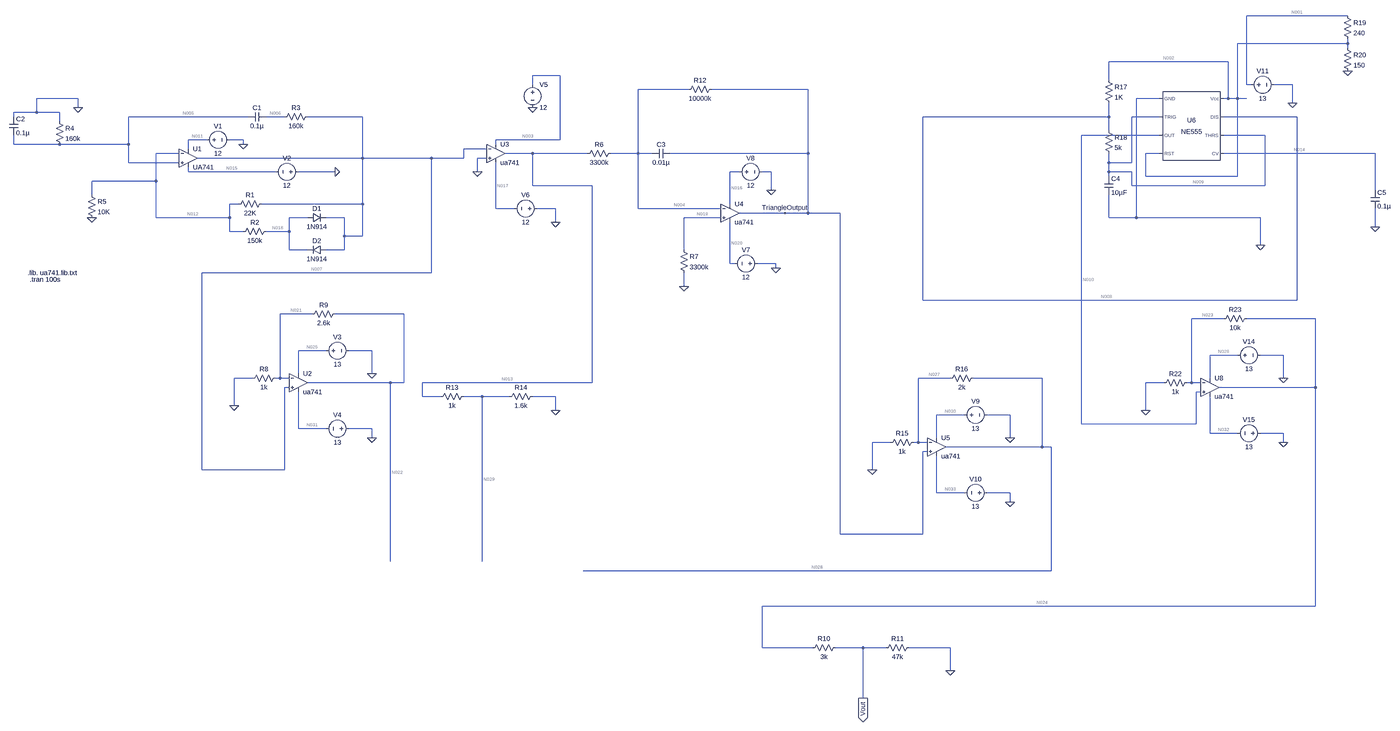
[diagram p0: schematic Final perfect.asc, whole sheet]
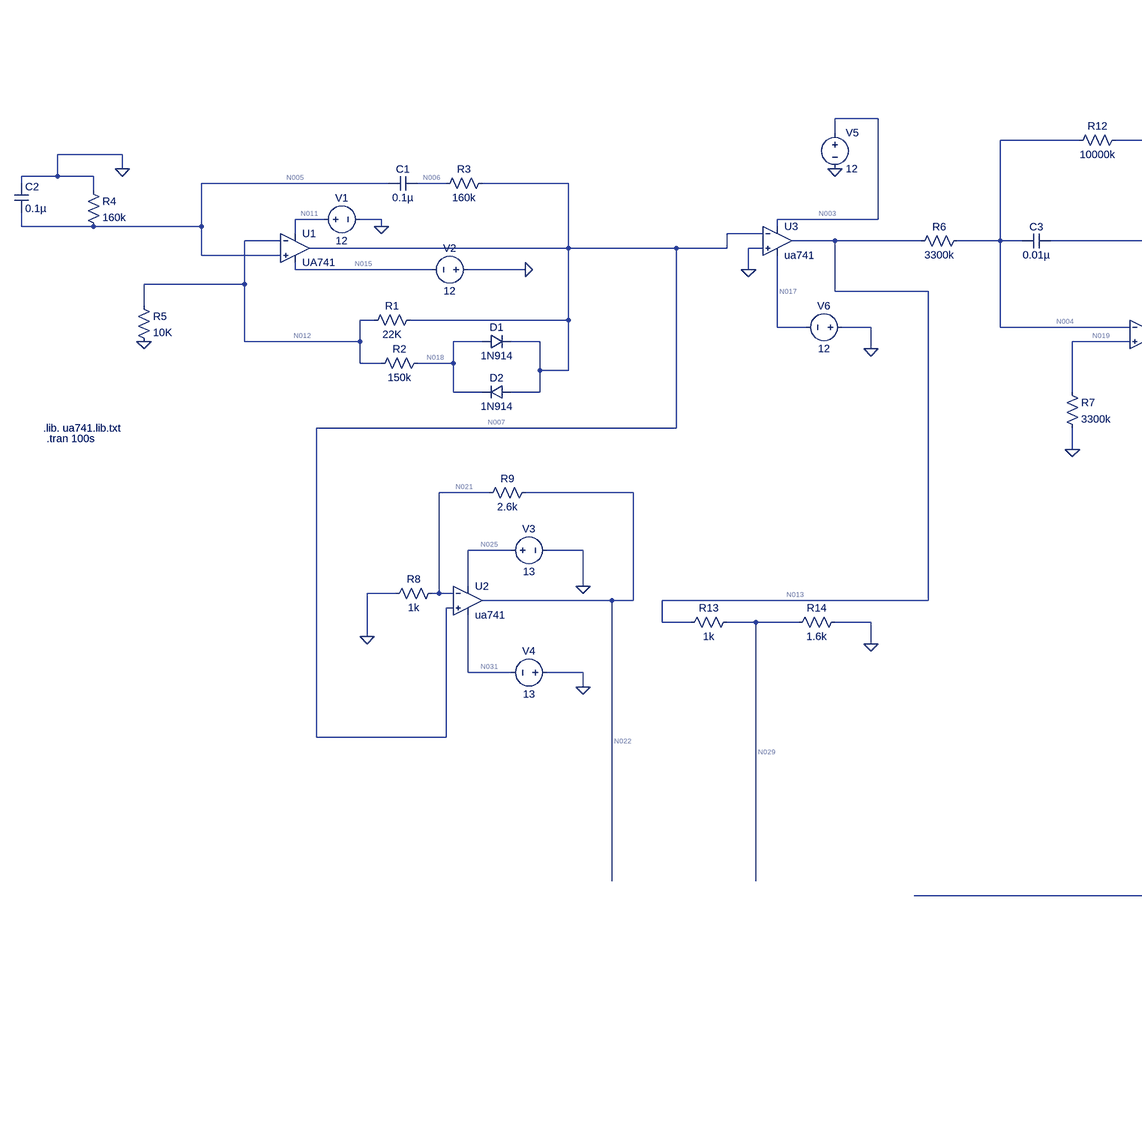
[diagram p1: schematic Final perfect.asc, part, row 1 of 1, column 1 of 2]
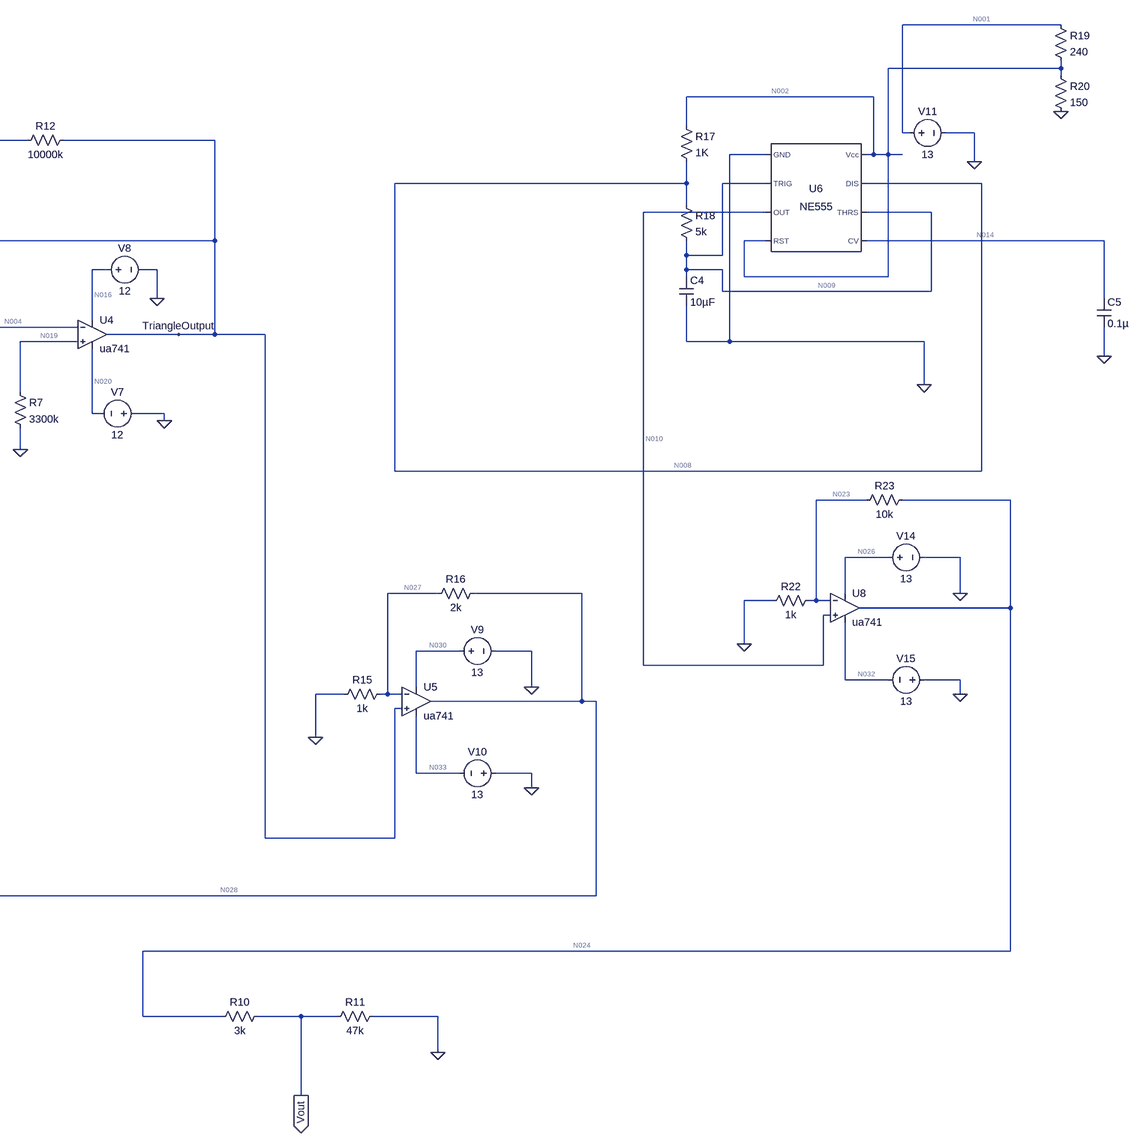
[diagram p2: schematic Final perfect.asc, part, row 1 of 1, column 2 of 2]
Final perfect.asc, the LTspice schematic file:
Version 4
SHEET 1 5472 2544
WIRE 4304 -352 3952 -352
WIRE 4304 -256 4304 -272
WIRE 4304 -256 3920 -256
WIRE 4304 -240 4304 -256
WIRE 3888 -192 3472 -192
WIRE 1536 -144 1440 -144
WIRE 3472 -128 3472 -192
WIRE 1440 -112 1440 -144
WIRE 3952 -112 3952 -352
WIRE 3968 -112 3952 -112
WIRE 4112 -112 4048 -112
WIRE 1984 -96 1808 -96
WIRE 2400 -96 2064 -96
WIRE -144 -64 -288 -64
WIRE 3648 -64 3568 -64
WIRE 3888 -64 3888 -192
WIRE 3888 -64 3872 -64
WIRE 3920 -64 3920 -256
WIRE 3920 -64 3888 -64
WIRE 3952 -64 3920 -64
WIRE 4112 -48 4112 -112
WIRE -144 -32 -144 -64
WIRE -288 -16 -288 -64
WIRE -288 -16 -368 -16
WIRE -208 -16 -288 -16
WIRE -368 0 -368 -16
WIRE 448 0 32 0
WIRE 576 0 512 0
WIRE 848 0 656 0
WIRE 3472 0 3472 -48
WIRE 3472 0 2800 0
WIRE 3648 0 3552 0
WIRE 4128 0 3872 0
WIRE -208 16 -208 -16
WIRE 3472 48 3472 0
WIRE 3648 64 3376 64
WIRE 4016 64 3872 64
WIRE 304 80 240 80
WIRE 432 80 384 80
WIRE 1536 80 1536 -144
WIRE 1536 80 1312 80
WIRE -368 96 -368 64
WIRE -208 96 -368 96
WIRE 32 96 32 0
WIRE 32 96 -208 96
WIRE 432 96 432 80
WIRE 1312 96 1312 80
WIRE 240 112 240 80
WIRE 1280 112 1200 112
WIRE 208 128 128 128
WIRE 1440 128 1344 128
WIRE 1632 128 1440 128
WIRE 1808 128 1808 -96
WIRE 1808 128 1712 128
WIRE 1856 128 1808 128
WIRE 2400 128 2400 -96
WIRE 2400 128 1920 128
WIRE 3648 128 3600 128
WIRE 4400 128 3872 128
WIRE 848 144 848 0
WIRE 848 144 272 144
WIRE 1088 144 848 144
WIRE 1200 144 1200 112
WIRE 1200 144 1088 144
WIRE 1280 144 1248 144
WIRE 32 160 32 96
WIRE 208 160 32 160
WIRE 3472 160 3472 128
WIRE 3552 160 3552 0
WIRE 3552 160 3472 160
WIRE 240 192 240 176
WIRE 544 192 240 192
WIRE 752 192 624 192
WIRE 1248 192 1248 144
WIRE 2160 192 2128 192
WIRE 2272 192 2240 192
WIRE 3472 192 3472 160
WIRE 3552 192 3472 192
WIRE 3472 208 3472 192
WIRE 3600 208 3600 128
WIRE 3920 208 3920 -64
WIRE 3920 208 3600 208
WIRE 128 224 128 128
WIRE 128 224 -96 224
WIRE 1440 240 1440 128
WIRE 1648 240 1440 240
WIRE 3552 240 3552 192
WIRE 4016 240 4016 64
WIRE 4016 240 3552 240
WIRE 2272 256 2272 192
WIRE 4400 256 4400 128
WIRE -96 272 -96 224
WIRE 416 304 384 304
WIRE 848 304 848 144
WIRE 848 304 496 304
WIRE 2128 304 2128 192
WIRE 1312 320 1312 160
WIRE 1376 320 1312 320
WIRE 1520 320 1456 320
WIRE 1808 320 1808 128
WIRE 2096 320 1808 320
WIRE 2320 336 2160 336
WIRE 2400 336 2400 128
WIRE 2400 336 2320 336
WIRE 2512 336 2400 336
WIRE 128 352 128 224
WIRE 384 352 384 304
WIRE 384 352 128 352
WIRE 656 352 592 352
WIRE 784 352 720 352
WIRE 2096 352 1968 352
WIRE 3472 352 3472 272
WIRE 3568 352 3568 -64
WIRE 3568 352 3472 352
WIRE 4000 352 3568 352
WIRE 1520 368 1520 320
WIRE 4400 384 4400 320
WIRE 384 400 384 352
WIRE 432 400 384 400
WIRE 592 400 592 352
WIRE 592 400 512 400
WIRE 784 416 784 352
WIRE 848 416 848 304
WIRE 848 416 784 416
WIRE 4000 448 4000 352
WIRE 592 464 592 400
WIRE 656 464 592 464
WIRE 784 464 784 416
WIRE 784 464 720 464
WIRE 1968 464 1968 352
WIRE 2128 512 2128 368
WIRE 2144 512 2128 512
WIRE 2288 512 2224 512
WIRE 2288 528 2288 512
WIRE 1088 544 1088 144
WIRE 1088 544 288 544
WIRE 1968 592 1968 544
WIRE 2800 640 2800 0
WIRE 4128 640 4128 0
WIRE 4128 640 2800 640
WIRE 672 688 560 688
WIRE 992 688 752 688
WIRE 3872 704 3760 704
WIRE 4192 704 3952 704
WIRE 720 816 624 816
WIRE 880 816 800 816
WIRE 3920 832 3824 832
WIRE 4080 832 4000 832
WIRE 624 896 624 816
WIRE 880 896 880 816
WIRE 464 912 400 912
WIRE 560 912 560 688
WIRE 560 912 544 912
WIRE 592 912 560 912
WIRE 2896 912 2784 912
WIRE 3216 912 2976 912
WIRE 3824 912 3824 832
WIRE 4080 912 4080 832
WIRE 944 928 656 928
WIRE 992 928 992 688
WIRE 992 928 944 928
WIRE 1648 928 1648 240
WIRE 1648 928 1056 928
WIRE 3664 928 3600 928
WIRE 3760 928 3760 704
WIRE 3760 928 3744 928
WIRE 3792 928 3760 928
WIRE 592 944 576 944
WIRE 4192 944 4192 704
WIRE 4192 944 3856 944
WIRE 3792 960 3776 960
WIRE 1056 976 1056 928
WIRE 1120 976 1056 976
WIRE 1264 976 1200 976
WIRE 1360 976 1264 976
WIRE 1520 976 1440 976
WIRE 400 1008 400 912
WIRE 1520 1024 1520 976
WIRE 3600 1024 3600 928
WIRE 2944 1040 2848 1040
WIRE 3104 1040 3024 1040
WIRE 3376 1072 3376 64
WIRE 3776 1072 3776 960
WIRE 3776 1072 3376 1072
WIRE 624 1088 624 960
WIRE 720 1088 624 1088
WIRE 880 1088 800 1088
WIRE 3824 1104 3824 976
WIRE 3920 1104 3824 1104
WIRE 4080 1104 4000 1104
WIRE 880 1120 880 1088
WIRE 2848 1120 2848 1040
WIRE 3104 1120 3104 1040
WIRE 2688 1136 2624 1136
WIRE 2784 1136 2784 912
WIRE 2784 1136 2768 1136
WIRE 2816 1136 2784 1136
WIRE 4080 1136 4080 1104
WIRE 3216 1152 3216 912
WIRE 3216 1152 2880 1152
WIRE 3248 1152 3216 1152
WIRE 2816 1168 2800 1168
WIRE 288 1232 288 544
WIRE 576 1232 576 944
WIRE 576 1232 288 1232
WIRE 2624 1232 2624 1136
WIRE 2848 1312 2848 1184
WIRE 2944 1312 2848 1312
WIRE 3104 1312 3024 1312
WIRE 3104 1344 3104 1312
WIRE 2512 1456 2512 336
WIRE 2800 1456 2800 1168
WIRE 2800 1456 2512 1456
WIRE 944 1552 944 928
WIRE 1264 1552 1264 976
WIRE 3248 1584 3248 1152
WIRE 3248 1584 1616 1584
WIRE 4192 2048 4192 944
WIRE 4192 2048 2240 2048
WIRE 2240 2256 2240 2048
WIRE 2416 2256 2240 2256
WIRE 2592 2256 2496 2256
WIRE 2672 2256 2592 2256
WIRE 2896 2256 2752 2256
WIRE 2896 2336 2896 2256
WIRE 2592 2432 2592 2256
FLAG -144 -32 0
FLAG -96 352 0
FLAG 432 96 0
FLAG 752 192 0
FLAG 400 1008 0
FLAG 880 896 0
FLAG 880 1120 0
FLAG 2896 2336 0
FLAG 2592 2432 Vout
IOPIN 2592 2432 Out
FLAG 1440 -32 0
FLAG 1520 368 0
FLAG 1248 192 0
FLAG 1520 1024 0
FLAG 2272 256 0
FLAG 2288 528 0
FLAG 1968 592 0
FLAG 2624 1232 0
FLAG 3104 1120 0
FLAG 3104 1344 0
FLAG 2320 336 TriangleOutput
FLAG 4112 -48 0
FLAG 4000 448 0
FLAG 4304 -160 0
FLAG 4400 384 0
FLAG 3600 1024 0
FLAG 4080 912 0
FLAG 4080 1136 0
SYMBOL OpAmps\\opamp2 240 80 R0
SYMATTR InstName U1
SYMATTR Value UA741
SYMBOL res 512 288 R90
WINDOW 0 0 56 VBottom 2
WINDOW 3 32 56 VTop 2
SYMATTR InstName R1
SYMATTR Value 22K
SYMBOL res 528 384 R90
WINDOW 0 0 56 VBottom 2
WINDOW 3 32 56 VTop 2
SYMATTR InstName R2
SYMATTR Value 150k
SYMBOL diode 656 368 R270
WINDOW 0 32 32 VTop 2
WINDOW 3 0 32 VBottom 2
SYMATTR InstName D1
SYMATTR Value 1N914
SYMBOL diode 720 448 R90
WINDOW 0 0 32 VBottom 2
WINDOW 3 32 32 VTop 2
SYMATTR InstName D2
SYMATTR Value 1N914
SYMBOL res 672 -16 R90
WINDOW 0 0 56 VBottom 2
WINDOW 3 32 56 VTop 2
SYMATTR InstName R3
SYMATTR Value 160k
SYMBOL cap 512 -16 R90
WINDOW 0 0 32 VBottom 2
WINDOW 3 32 32 VTop 2
SYMATTR InstName C1
SYMATTR Value 0.1µ
SYMBOL cap -384 0 R0
SYMATTR InstName C2
SYMATTR Value 0.1µ
SYMBOL res -224 0 R0
SYMATTR InstName R4
SYMATTR Value 160k
SYMBOL res -112 256 R0
SYMATTR InstName R5
SYMATTR Value 10K
SYMBOL voltage 288 80 R270
WINDOW 0 32 56 VTop 2
WINDOW 3 -32 56 VBottom 2
WINDOW 123 0 0 Left 0
WINDOW 39 0 0 Left 0
SYMATTR InstName V1
SYMATTR Value 12
SYMBOL voltage 640 192 R90
WINDOW 0 -32 56 VBottom 2
WINDOW 3 32 56 VTop 2
WINDOW 123 0 0 Left 0
WINDOW 39 0 0 Left 0
SYMATTR InstName V2
SYMATTR Value 12
SYMBOL OpAmps\\ua741 624 864 R0
SYMATTR InstName U2
SYMBOL res 560 896 R90
WINDOW 0 0 56 VBottom 2
WINDOW 3 32 56 VTop 2
SYMATTR InstName R8
SYMATTR Value 1k
SYMBOL voltage 704 816 R270
WINDOW 0 32 56 VTop 2
WINDOW 3 -32 56 VBottom 2
SYMATTR InstName V3
SYMATTR Value 13
SYMBOL voltage 816 1088 R90
WINDOW 0 -32 56 VBottom 2
WINDOW 3 32 56 VTop 2
SYMATTR InstName V4
SYMATTR Value 13
SYMBOL res 768 672 R90
WINDOW 0 0 56 VBottom 2
WINDOW 3 32 56 VTop 2
SYMATTR InstName R9
SYMATTR Value 2.6k
SYMBOL res 2512 2240 R90
WINDOW 0 0 56 VBottom 2
WINDOW 3 32 56 VTop 2
SYMATTR InstName R10
SYMATTR Value 3k
SYMBOL res 2768 2240 R90
WINDOW 0 0 56 VBottom 2
WINDOW 3 32 56 VTop 2
SYMATTR InstName R11
SYMATTR Value 47k
SYMBOL voltage 1440 -128 R0
WINDOW 123 0 0 Left 0
WINDOW 39 0 0 Left 0
SYMATTR InstName V5
SYMATTR Value 12
SYMBOL voltage 1472 320 R90
WINDOW 0 -32 56 VBottom 2
WINDOW 3 32 56 VTop 2
WINDOW 123 0 0 Left 0
WINDOW 39 0 0 Left 0
SYMATTR InstName V6
SYMATTR Value 12
SYMBOL OpAmps\\ua741 1312 64 R0
SYMATTR InstName U3
SYMBOL res 1216 960 R90
WINDOW 0 0 56 VBottom 2
WINDOW 3 32 56 VTop 2
SYMATTR InstName R13
SYMATTR Value 1k
SYMBOL res 1456 960 R90
WINDOW 0 0 56 VBottom 2
WINDOW 3 32 56 VTop 2
SYMATTR InstName R14
SYMATTR Value 1.6k
SYMBOL res 1728 112 R90
WINDOW 0 0 56 VBottom 2
WINDOW 3 32 56 VTop 2
SYMATTR InstName R6
SYMATTR Value 3300k
SYMBOL voltage 2240 512 R90
WINDOW 0 -32 56 VBottom 2
WINDOW 3 32 56 VTop 2
SYMATTR InstName V7
SYMATTR Value 12
SYMBOL voltage 2144 192 R270
WINDOW 0 32 56 VTop 2
WINDOW 3 -32 56 VBottom 2
SYMATTR InstName V8
SYMATTR Value 12
SYMBOL cap 1920 112 R90
WINDOW 0 0 32 VBottom 2
WINDOW 3 32 32 VTop 2
SYMATTR InstName C3
SYMATTR Value 0.01µ
SYMBOL res 1952 448 R0
SYMATTR InstName R7
SYMATTR Value 3300k
SYMBOL res 2080 -112 R90
WINDOW 0 0 56 VBottom 2
WINDOW 3 32 56 VTop 2
SYMATTR InstName R12
SYMATTR Value 10000k
SYMBOL OpAmps\\ua741 2128 272 R0
SYMATTR InstName U4
SYMBOL OpAmps\\ua741 2848 1088 R0
SYMATTR InstName U5
SYMBOL res 2784 1120 R90
WINDOW 0 0 56 VBottom 2
WINDOW 3 32 56 VTop 2
SYMATTR InstName R15
SYMATTR Value 1k
SYMBOL voltage 2928 1040 R270
WINDOW 0 32 56 VTop 2
WINDOW 3 -32 56 VBottom 2
SYMATTR InstName V9
SYMATTR Value 13
SYMBOL voltage 3040 1312 R90
WINDOW 0 -32 56 VBottom 2
WINDOW 3 32 56 VTop 2
SYMATTR InstName V10
SYMATTR Value 13
SYMBOL res 2992 896 R90
WINDOW 0 0 56 VBottom 2
WINDOW 3 32 56 VTop 2
SYMATTR InstName R16
SYMATTR Value 2k
SYMBOL Misc\\NE555 3760 32 R0
SYMATTR InstName U6
SYMBOL voltage 3952 -112 R270
WINDOW 0 32 56 VTop 2
WINDOW 3 -32 56 VBottom 2
WINDOW 123 0 0 Left 0
WINDOW 39 0 0 Left 0
SYMATTR InstName V11
SYMATTR Value 13
SYMBOL res 3456 -144 R0
SYMATTR InstName R17
SYMATTR Value 1K
SYMBOL res 3456 32 R0
SYMATTR InstName R18
SYMATTR Value 5k
SYMBOL cap 3456 208 R0
SYMATTR InstName C4
SYMATTR Value 10µF
SYMBOL res 4288 -368 R0
SYMATTR InstName R19
SYMATTR Value 240
SYMBOL res 4288 -256 R0
SYMATTR InstName R20
SYMATTR Value 150
SYMBOL cap 4384 256 R0
SYMATTR InstName C5
SYMATTR Value 0.1µ
SYMBOL OpAmps\\ua741 3824 880 R0
SYMATTR InstName U8
SYMBOL res 3760 912 R90
WINDOW 0 0 56 VBottom 2
WINDOW 3 32 56 VTop 2
SYMATTR InstName R22
SYMATTR Value 1k
SYMBOL voltage 3904 832 R270
WINDOW 0 32 56 VTop 2
WINDOW 3 -32 56 VBottom 2
SYMATTR InstName V14
SYMATTR Value 13
SYMBOL voltage 4016 1104 R90
WINDOW 0 -32 56 VBottom 2
WINDOW 3 32 56 VTop 2
SYMATTR InstName V15
SYMATTR Value 13
SYMBOL res 3968 688 R90
WINDOW 0 0 56 VBottom 2
WINDOW 3 32 56 VTop 2
SYMATTR InstName R23
SYMATTR Value 10k
TEXT -320 544 Left 2 !.lib. ua741.lib.txt
TEXT -312 568 Left 2 !.tran 100s

The netlist it stands for:
* Final perfect.asc
XU1 N005 N012 N011 N015 N007 UA741  ; pins In+ In- V+ V- OUT
R1 N007 N012 22K
R2 N018 N012 150k
D1 N018 N007 1N914
D2 N007 N018 1N914
R3 N007 N006 160k
C1 N006 N005 0.1µ
C2 0 N005 0.1µ
R4 0 N005 160k
R5 N012 0 10K
V1 N011 0 12
V2 0 N015 12
XU2 N007 N021 N025 N031 N022 ua741  ; pins In+ In- V+ V- OUT
R8 N021 0 1k
V3 N025 0 13
V4 0 N031 13
R9 N022 N021 2.6k
R10 Vout N024 3k
R11 0 Vout 47k
V5 N003 0 12
V6 0 N017 12
XU3 0 N007 N003 N017 N013 ua741  ; pins In+ In- V+ V- OUT
R13 N029 N013 1k
R14 0 N029 1.6k
R6 N004 N013 3300k
V7 0 N020 12
V8 N016 0 12
C3 TriangleOutput N004 0.01µ
R7 N019 0 3300k
R12 TriangleOutput N004 10000k
XU4 N019 N004 N016 N020 TriangleOutput ua741  ; pins In+ In- V+ V- OUT
XU5 TriangleOutput N027 N030 N033 N028 ua741  ; pins In+ In- V+ V- OUT
R15 N027 0 1k
V9 N030 0 13
V10 0 N033 13
R16 N028 N027 2k
XU6 0 N009 N010 N002 N014 N009 N008 N002 NE555  ; pins GND TRIG OUT RST CV THRS DIS Vcc
V11 N001 0 13
R17 N002 N008 1K
R18 N008 N009 5k
C4 N009 0 10µF
R19 N001 N002 240
R20 N002 0 150
C5 N014 0 0.1µ
XU8 N010 N023 N026 N032 N024 ua741  ; pins In+ In- V+ V- OUT
R22 N023 0 1k
V14 N026 0 13
V15 0 N032 13
R23 N024 N023 10k
.model D D
.lib standard.dio
.lib. ua741.lib.txt
.tran 100s
.lib NE555.sub
.backanno
.end

* Results of the author's LTspice run, read from the files saved beside the schematic
* Operating Point, zero values left out:
*   V(n007) = -38.93 mV
*   V(n015) = -12 V
*   V(n011) = 12 V
*   V(n012) = -12.74 mV
*   V(n005) = -12.76 mV
*   V(n018) = -13.19 mV
*   V(n006) = -38.93 mV
*   V(n022) = -139.9 mV
*   V(n031) = -13 V
*   V(n025) = 13 V
*   V(n021) = -38.91 mV
*   V(vout) = 11.86 V
*   V(n024) = 12.61 V
*   V(n003) = 12 V
*   V(n017) = -12 V
*   V(n013) = 11.59 V
*   V(n029) = 7.134 V
*   V(n004) = 5.429 V
*   V(n020) = -12 V
*   V(n016) = 12 V
*   V(triangleoutput) = -11.61 V
*   V(n019) = 55.4 µV
*   V(n028) = -12.61 V
*   V(n033) = -13 V
*   V(n030) = 13 V
*   V(n027) = -4.205 V
*   V(n009) = 4.856 V
*   V(n014) = 3.237 V
*   V(n002) = 4.856 V
*   V(n008) = 4.856 V
*   V(n010) = 4.856 V
*   V(n001) = 13 V
*   V(n032) = -13 V
*   V(n026) = 13 V
*   V(n023) = 1.147 V
*   I(D2) = -1.092 nA
*   I(D1) = 1.928 nA
*   I(R23) = 1.147 mA
*   I(R22) = 1.147 mA
*   I(R20) = 32.37 mA
*   I(R19) = 33.94 mA
*   I(R18) = 9.711 nA
*   I(R17) = 16.19 nA
*   I(R16) = -4.205 mA
*   I(R15) = -4.205 mA
*   I(R12) = -1.704 µA
*   I(R7) = 16.79 pA
*   I(R6) = -1.868 µA
*   I(R14) = -4.459 mA
*   I(R13) = -4.459 mA
*   I(R11) = -252.3 µA
*   I(R10) = -252.3 µA
*   I(R9) = -38.83 µA
*   I(R8) = -38.91 µA
*   I(R5) = -1.274 µA
*   I(R4) = 79.72 nA
*   I(R2) = -3.02 nA
*   I(R1) = -1.191 µA
*   I(V15) = -1.447 mA
*   I(V14) = -1.431 mA
*   I(V11) = -33.94 mA
*   I(V10) = -1.431 mA
*   I(V9) = -1.446 mA
*   I(V8) = -1.337 mA
*   I(V7) = -1.32 mA
*   I(V6) = -1.337 mA
*   I(V5) = -1.329 mA
*   I(V4) = -1.447 mA
*   I(V3) = -1.447 mA
*   I(V2) = -1.337 mA
*   I(V1) = -1.337 mA